# Altium schematic sheet LPCB278 - TOP.SchDoc
size A3; Address1: Factory 10; Address2: 9-13 Dingley Avenue, Dandeong, VICTORIA 3175, AUSTRALIA; DocumentNumber: 1; Revision: 1; SheetNumber: 1; SheetTotal: 5; Lockie__PCB_SUB_ASSEMBLY: PCB Sub Component; Lockie__PCB_ASSEMBLY: PCB Assembly; Lockie__LDL: LPCB278; Lockie__PCB_DESCRIPTION: HE Thermal Module
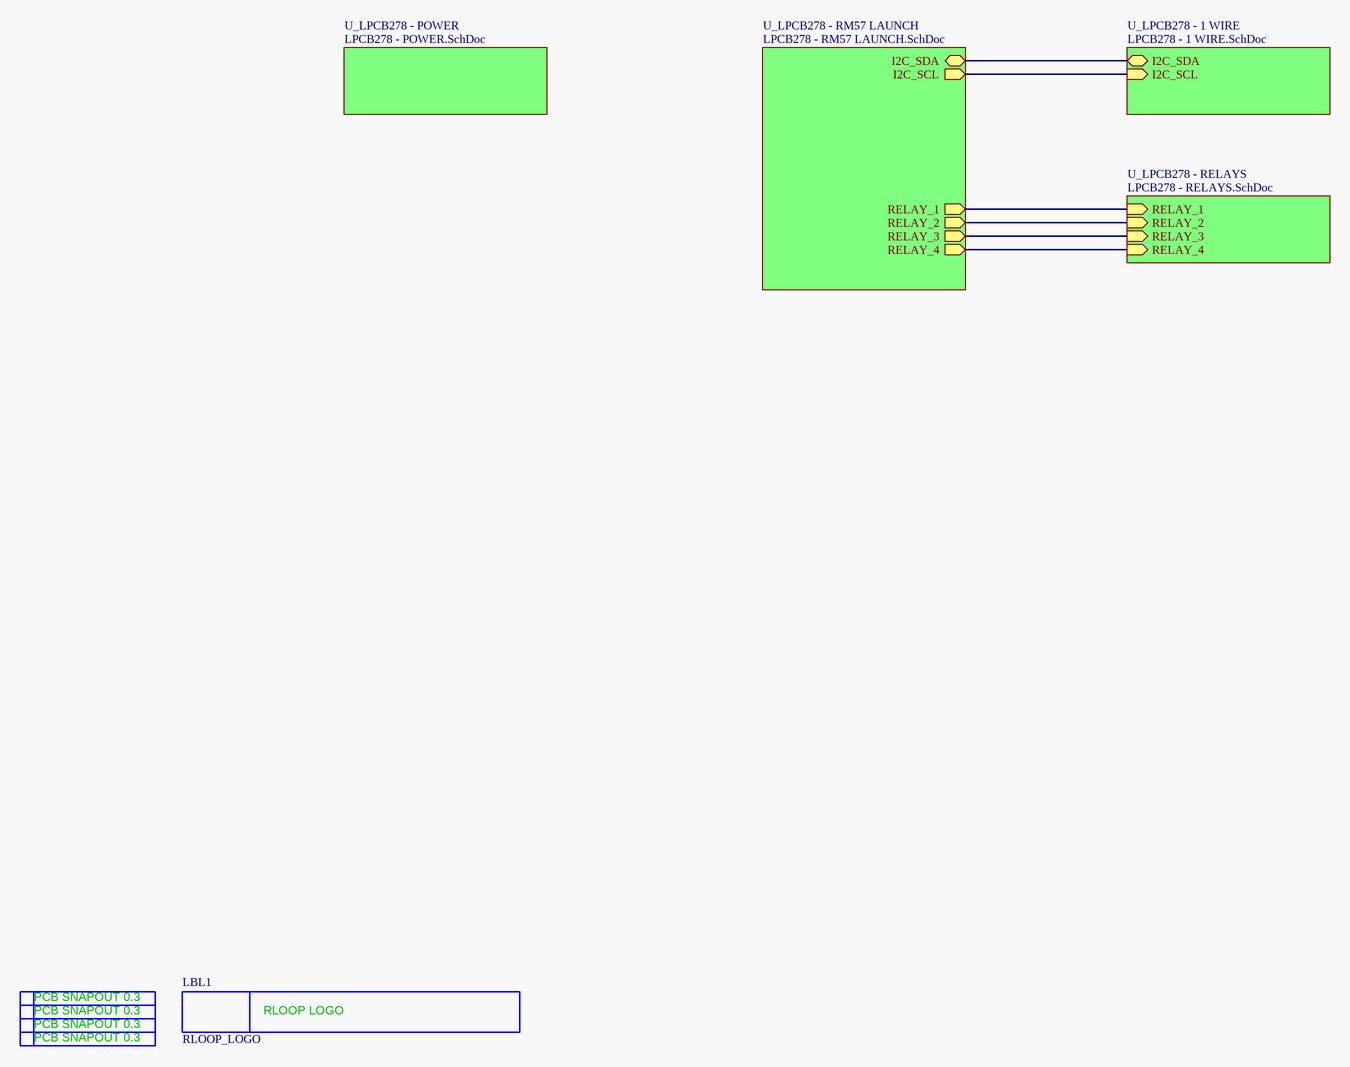
[diagram p0: LPCB278 - TOP.SchDoc]

## Parts
LBL1  RLOOP_LOGO  [RLOOP_LOGO]  (no BOM)
SN1  PCB_SNAPOUT_0.3MM  [PCB_SNAPOUT_0.3MM]  (value not drawn)  (no BOM)
SN2  PCB_SNAPOUT_0.3MM  [PCB_SNAPOUT_0.3MM]  (value not drawn)  (no BOM)
SN3  PCB_SNAPOUT_0.3MM  [PCB_SNAPOUT_0.3MM]  (value not drawn)  (no BOM)
SN4  PCB_SNAPOUT_0.3MM  [PCB_SNAPOUT_0.3MM]  (value not drawn)  (no BOM)

## Sub-sheets
U_LPCB278 - 1 WIRE = LPCB278 - 1 WIRE.SchDoc: I2C_SDA (bidir), I2C_SCL (in)
U_LPCB278 - POWER = LPCB278 - POWER.SchDoc: no entries
U_LPCB278 - RELAYS = LPCB278 - RELAYS.SchDoc: RELAY_1 (in), RELAY_2 (in), RELAY_3 (in), RELAY_4 (in)
U_LPCB278 - RM57 LAUNCH = LPCB278 - RM57 LAUNCH.SchDoc: I2C_SDA (bidir), I2C_SCL (out), RELAY_1 (out), RELAY_2 (out), RELAY_3 (out), RELAY_4 (out)

## Nets
(unnamed): sheet U_LPCB278 - 1 WIRE/I2C_SDA, sheet U_LPCB278 - RM57 LAUNCH/I2C_SDA
(unnamed): sheet U_LPCB278 - 1 WIRE/I2C_SCL, sheet U_LPCB278 - RM57 LAUNCH/I2C_SCL
(unnamed): sheet U_LPCB278 - RM57 LAUNCH/RELAY_1, sheet U_LPCB278 - RELAYS/RELAY_1
(unnamed): sheet U_LPCB278 - RM57 LAUNCH/RELAY_2, sheet U_LPCB278 - RELAYS/RELAY_2
(unnamed): sheet U_LPCB278 - RM57 LAUNCH/RELAY_3, sheet U_LPCB278 - RELAYS/RELAY_3
(unnamed): sheet U_LPCB278 - RM57 LAUNCH/RELAY_4, sheet U_LPCB278 - RELAYS/RELAY_4

## Notes on the sheet
- PCB COMPONENT DESCRIPTION
- LDL NUMBER
- Assembly Details
- Size
- Drawing File Name
- Revision
- http://rloop.org
- Scale
- A3
- Sheet Details
- N.T.S
- Sheet:
- Of:
- (in symbol PCB_SNAPOUT_0.3MM) PCB SNAPOUT 0.3
- (in symbol RLOOP_LOGO) RLOOP LOGO

## Library data of the parts
LBL1 = RLOOP_LOGO: FMEDA__CHANNEL: DIAG; FMEDA__FUNCTION_IN_SYSTEM: *
SN1-SN4 = PCB_SNAPOUT_0.3MM: PCB Snapout + 0.3mm; FMEDA__CHANNEL: DIAG; FMEDA__FUNCTION_IN_SYSTEM: *